# EAGLE schematic Nusbio 2-FT4222 (EAGLE 7.6.0)
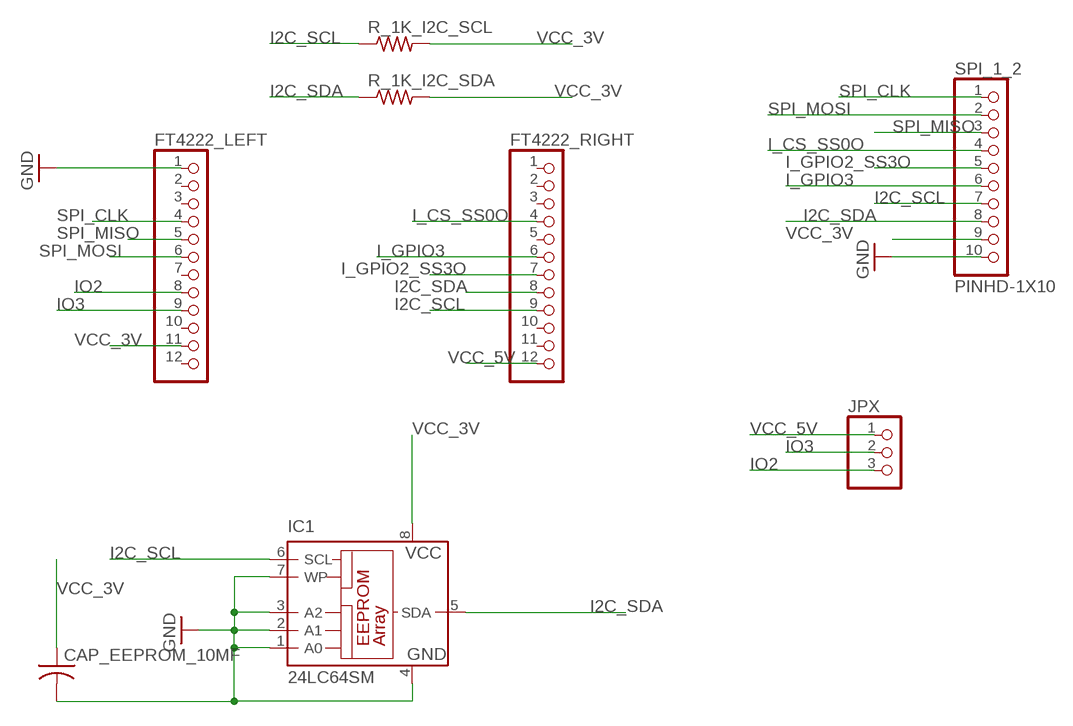
[diagram p0: schematic, sheet 1]

## Parts
CAP_EEPROM_10MF  C-USC1206  [C1206]
FT4222_LEFT  PINHD-1X12  [1X12]
FT4222_RIGHT  PINHD-1X12  [1X12]
IC1  24LC64SM  [SO-08M]
JPX  PINHD-1X3  [1X03]
R_1K_I2C_SCL  R-US_R1206  [R1206]
R_1K_I2C_SDA  R-US_R1206  [R1206]
SPI_1_2  PINHD-1X10  [1X10-BIG]

## Nets
GND: CAP_EEPROM_10MF.2 FT4222_LEFT.1 IC1.1(A0) IC1.2(A1) IC1.3(A2) IC1.4(GND) IC1.7(WP) SPI_1_2.10
I2C_SCL: FT4222_RIGHT.9 IC1.6(SCL) R_1K_I2C_SCL.1 SPI_1_2.7
I2C_SDA: FT4222_RIGHT.8 IC1.5(SDA) R_1K_I2C_SDA.1 SPI_1_2.8
I_CS_SS0O: FT4222_RIGHT.4 SPI_1_2.4
I_GPIO2_SS3O: FT4222_RIGHT.7 SPI_1_2.5
I_GPIO3: FT4222_RIGHT.6 SPI_1_2.6
IO2: FT4222_LEFT.8 JPX.3
IO3: FT4222_LEFT.9 JPX.2
SPI_CLK: FT4222_LEFT.4 SPI_1_2.1
SPI_MISO: FT4222_LEFT.5 SPI_1_2.3
SPI_MOSI: FT4222_LEFT.6 SPI_1_2.2
VCC_3V: CAP_EEPROM_10MF.1 FT4222_LEFT.11 IC1.8(VCC) R_1K_I2C_SCL.2 R_1K_I2C_SDA.2 SPI_1_2.9
VCC_5V: FT4222_RIGHT.12 JPX.1
Unconnected: FT4222_LEFT.2 FT4222_LEFT.3 FT4222_LEFT.7 FT4222_LEFT.10 FT4222_LEFT.12 FT4222_RIGHT.1 FT4222_RIGHT.2 FT4222_RIGHT.3 FT4222_RIGHT.5 FT4222_RIGHT.10 FT4222_RIGHT.11

## Library data of the parts
CAP_EEPROM_10MF = adafruit:C-US: CAPACITOR, American symbol
FT4222_LEFT FT4222_RIGHT = adafruit:PINHD-1X12: PIN HEADER
IC1 = microchip:24*: Serial EEPROM I2C; MF: MICROCHIP; MPN: 24LC64T-I/SN; OC_FARNELL: 9758070; OC_NEWARK: 12C2021
JPX = pinhead:PINHD-1X3: PIN HEADER
R_1K_I2C_SCL R_1K_I2C_SDA = adafruit:R-US_: RESISTOR, American symbol
SPI_1_2 = adafruit:PINHD-1X10: Pin header 1x10 0.1" spacing With round pins